# EAGLE design pwr_neg_bipolar (EAGLE 7.5.0)
Rusia Neagra MKII
TITLE: Rusia Neagra MKII
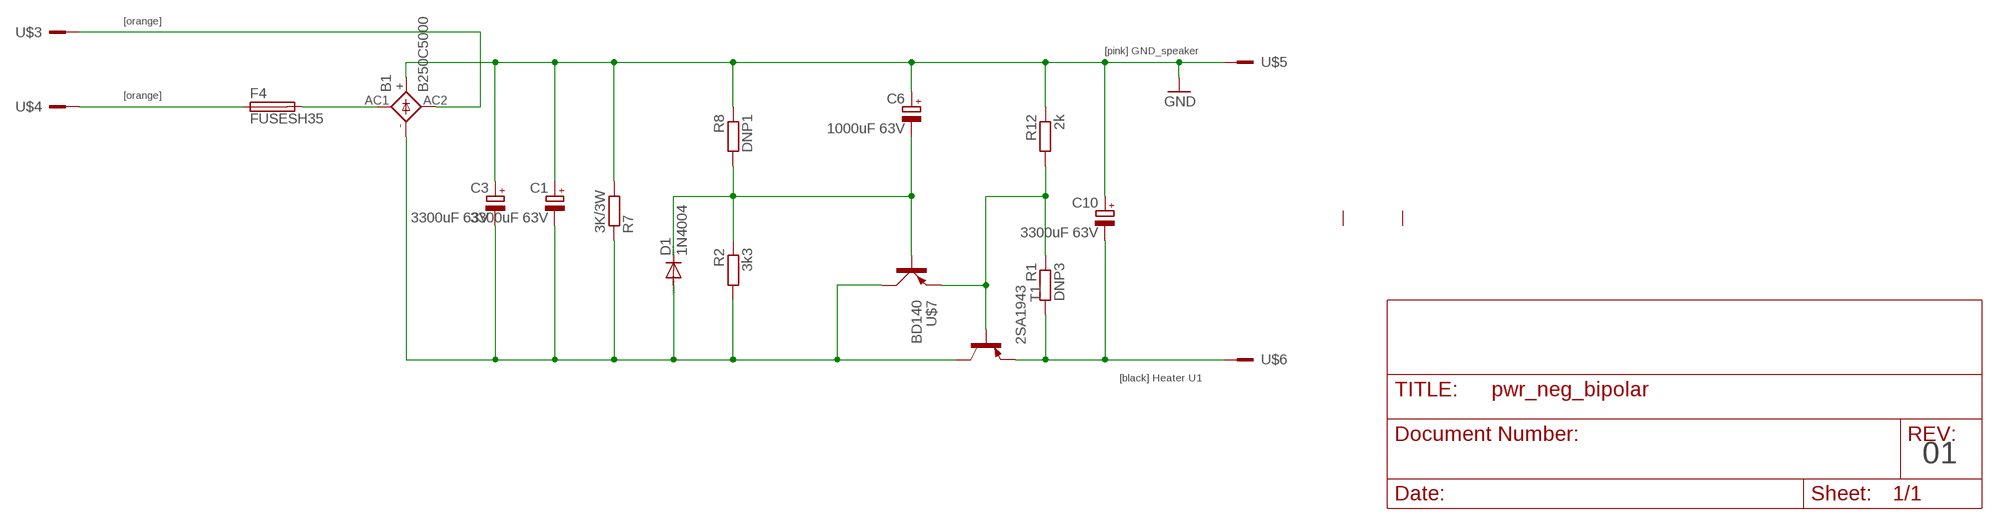
[diagram p0: schematic, sheet 1]

## Parts
B1  B250C5000  DIOTEC_BC5000  [DIOTEC_BC5000]
C1  3300uF 63V  CPOL-EUE10-20  [EB20D]
C3  3300uF 63V  CPOL-EUE10-20  [EB20D]
C6  1000uF 63V  CPOL-EUE7.5-16  [E7,5-16]
C10  3300uF 63V  CPOL-EUE10-20  [EB20D]
D1  1N4004  [DO41-10]
F4  FUSESH35  [SH25]
R1  DNP3  R-EU_0411/12  [0411/12]
R2  3k3  R-EU_0411/12  [0411/12]
R7  3K/3W  R-EU_0922V  [0922V]
R8  DNP1  R-EU_0411/12  [0411/12]
R12  2k  R-EU_0411/12  [0411/12]
T1  2SA1943  -PNP-TOP3V  [TOP3V]
U$1  SK456-60-3XM3L  [SK456-60-3XM3L]
U$2  RN_POWER  [RN]
U$3  M1  [M1_OFFSET]
U$4  M1  [M1_OFFSET]
U$5  M1  [M1_OFFSET]
U$6  M1  [M1_OFFSET]
U$7  BD140  PNP-POWER_VERT  [SOT32]

## Nets
30VAC_1: B1.AC2 U$3.1(KL)
30VAC_2: F4.1 U$4.1(KL)
GND: B1.+ C1.+ C3.+ C6.+ C10.+ R7.2 R8.1 R12.1 U$5.1(KL)
N$2: B1.AC1 F4.2
N$12: R1.1 R12.2 T1.B U$7.E
N$14: C6.- D1.C R2.1 R8.2 U$7.B
N_C: B1.- C1.- C3.- D1.A R2.2 R7.1 T1.C U$7.C
V-: C10.- R1.2 T1.E U$6.1(KL)
Unconnected: U$1.P$1 U$1.P$2 U$2.SH@1 U$2.SH@2 U$2.SH@3 U$2.SH@4

## Notes on the sheet
- [orange]
- [pink] GND_speaker
- [orange]
- [black] Heater U1
- 01

## Library data of the parts
B1 = Simplex-DiscreteSemi:DIOTEC_BC5000: DIOTEC RECTIFIER B..C5000-3000A, B..C5000-3300A grid 1 x 10, 2 x 7,5 mm
C1 C3 C6 C10 = rcl:CPOL-EU: POLARIZED CAPACITOR, European symbol
D1 = diode:1N4004: DIODE general purpose rectifier, 1 A
F4 = fuse:FUSE: Fuse; OC_FARNELL: unknown; OC_NEWARK: unknown
R1 R2 R7 R8 R12 = rcl:R-EU_: RESISTOR, European symbol
T1 = transistor:*-PNP-: PNP Transistror
U$1 = Simplex-Heatsinks:SK456-60-3XM3L: Fischer Elektronik SK456-60-3XM3L 2 pin heatsink 60x40, 40mm grid
U$2 = Simplex-Enclosures:RN_POWER: Rusia Neagra Amp power pcb
U$3-U$6 = Simplex-Connectors:M1: 1pin
U$7 = Simplex-DiscreteSemi:PNP-POWER: PNP power transistor

## Net classes
1 vcc: width 0.203 mm

## Board
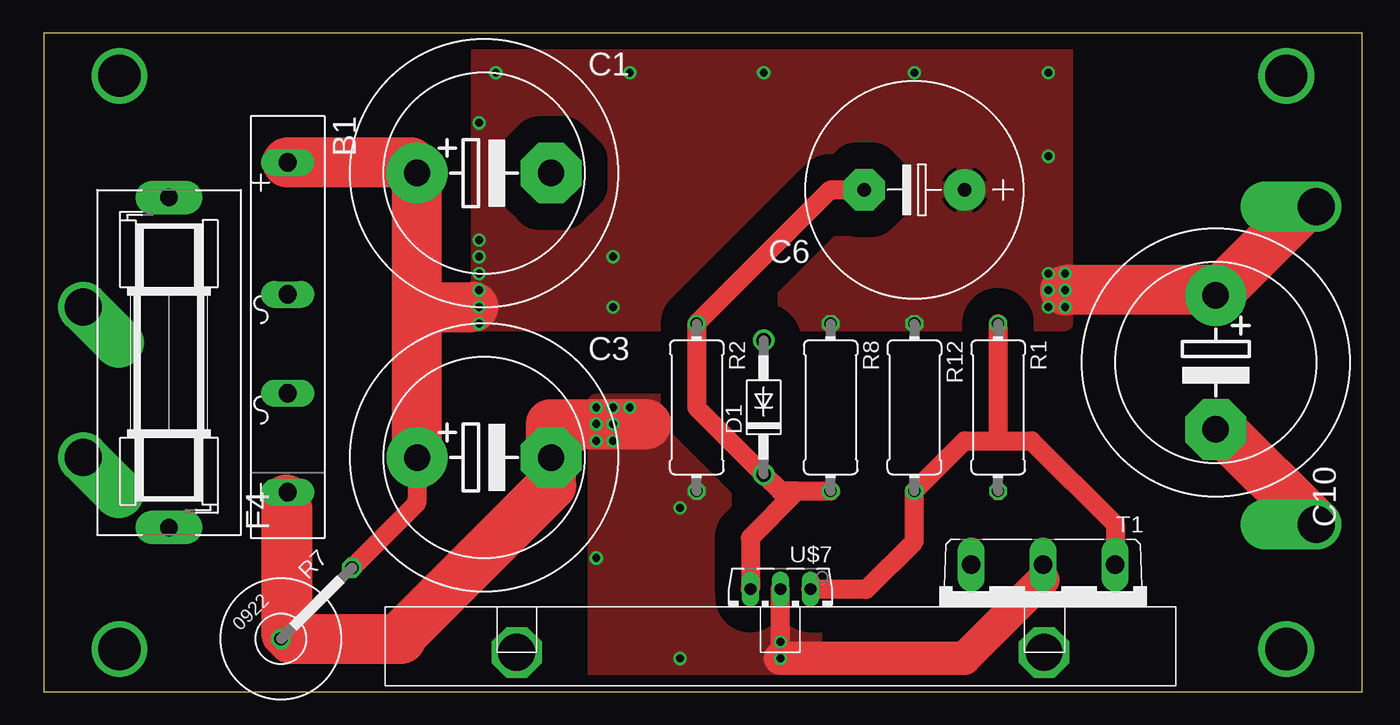
[diagram p1: board, top side]
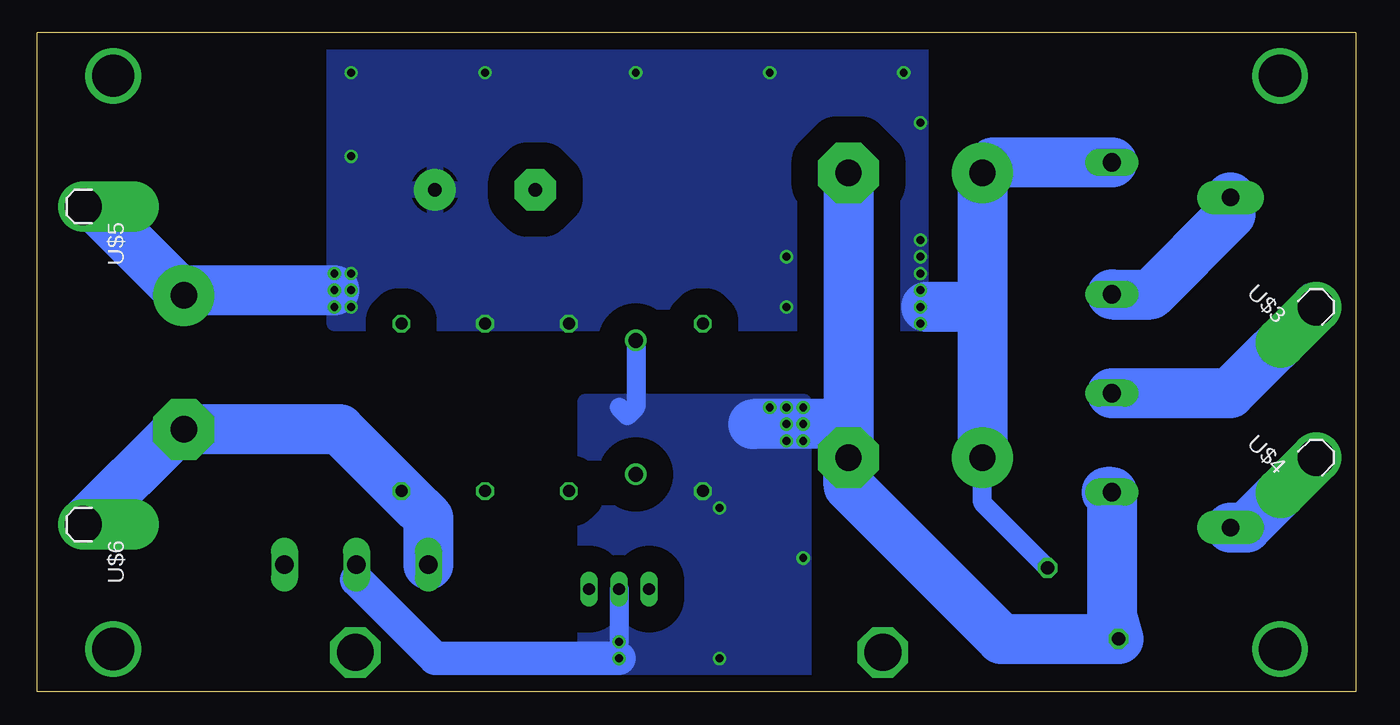
[diagram p2: board, bottom side, seen from below]

Size 100 x 50 mm. Coordinates in mm from the lower left corner, seen from the top.
Copper layers (1*16): Top 0.035mm / dielectric 1.5mm / Bottom 0.035mm
Design rules "default *": minimum track width 10mil, minimum drill 0.6mm, track to track 2mm, track to pad 2mm, pad to pad 2mm, via to via 2mm, smd to smd 2mm, copper to edge 40mil, drill to drill 8mil, minimum pad ring 0.15mm, minimum via ring 8mil, stop-mask expansion 4mil, vias tented up to drill 0mil, thermal gap 10mil

### Footprints (pad centres in the part's own frame; a part is rotated, then mirrored left to right if it is on the bottom)
DIOTEC_BC5000 = drill 1.397 long: + -13.5,0; - 11.5,0; AC1 -3.5,0; AC2 4,0
EB20D = drill 2.007 pad 4.597: + -5.08,0 | drill 2.007 pad 4.597 octagon: - 5.08,0
E7,5-16 = drill 1.016 pad 3.15: + -3.81,0 | drill 1.016 pad 3.15 octagon: - 3.81,0
DO41-10 = drill 1.118: A 5.08,0; C -5.08,0
SH25 = drill 1.321 pad 2.54 long: 1 -12.522,0; 2 12.522,0
0411/12 = drill 0.914 octagon: 1 -6.35,0; 2 6.35,0
0922V = drill 1.016 octagon: 1 -5.08,0; 2 2.54,0
TOP3V = drill 1.397 long: B -5.461,-3.175; C 0,-3.175; E 5.461,-3.175
SK456-60-3XM3L = drill 2.8 octagon: P$1 -20,0; P$2 20,0
RN = drill 3.2: SH@1 0,43.5; SH@2 88.5,43.5; SH@3 0,0; SH@4 88.5,0
M1_OFFSET = drill 2.8 pad 3.81 offset: 1 0,0
SOT32 = drill 0.9 pad 1.016 long: B 2.286,0; C 0,0; E -2.286,0

### Placement (x,y rotation side)
B1  18.5,26.67 270 top
C1  33.4,39.37 0 top
C3  33.4,17.78 0 top
C6  66.04,38.1 180 top
C10  88.9,25 270 top
D1  54.61,21.59 90 top
F4  9.5,25 90 top
R1  72.39,21.59 270 top
R2  49.53,21.59 270 top
R7  21.59,7.62 45 top
R8  59.69,21.59 270 top
R12  66.04,21.59 270 top
T1  75.8,6.5 180 top
U$1  55.88,3 0 top
U$2  5.75,3.25 0 top
U$3  3,29.21 135 bottom
U$4  3,17.78 135 bottom
U$5  96.52,36.83 270 bottom
U$6  96.52,12.7 270 bottom
U$7  55.88,7.8 180 top

### Tracks (layer width: path | path; a pad name or v marks a point on that pad's centre or on a via)
30VAC_1
  Bottom 3.81: B1.AC2 9.54,22.67 U$3.1
30VAC_2
  Bottom 3.81: F4.1 8.3,12.48 U$4.1
GND  (via drill 0.6 pad 0.3)
  Top 1.422: R7.2 28.32,14.35 | 28.32,18.04 C3.+ | C3.+ 28.32,14.61 | C3.+ 28.32,29.21 v33.02,29.21
  Top 3.81: v77.47,30.48 88.5,30.48 C10.+ 95.65,36.83 | 28.32,29.21 C1.+ | 28.32,18.41 28.32,29.21 | 28.32,29.21 32.6,29.21 | 27.86,40.17 B1.+
  Bottom 0.406: 32.6,29.21 v33.02,29.21
  Bottom 1.422: R7.2 28.32,14.35 C3.+
  Bottom 3.81: v77.47,30.48 88.5,30.48 C10.+ 95.65,36.83 U$5.1 | 28.32,29.21 C3.+ | B1.+ 27.52,40.17 C1.+ 28.32,29.21 | 28.32,29.21 32.6,29.21
  other vias: 34.29,46.99 43.18,33.02 33.02,43.18 76.2,40.64 76.2,46.99 77.47,29.21 44.45,46.99 54.61,46.99 66.04,46.99 43.18,29.21 33.02,33.02 76.2,30.48 76.2,31.75 33.02,30.48 33.02,27.94 33.02,31.75 33.02,34.29 77.47,31.75 76.2,29.21
  pour Bottom (isolate 1.27): 77.47,49.53 33.02,49.53 33.02,28 77.47,28
  pour Top (isolate 1.27): 33.02,49.53 77.47,49.53 77.47,28 33.02,28
N$2
  Bottom 3.81: B1.AC1 15.55,30.17 9.5,36.22 F4.2
N$12
  Top 1.27: 81.28,9.29 T1.B
  Top 1.422: 81.28,9.29 81.28,12.7 74.93,19.05 72.39,19.05 | U$7.E 58.32,7.77 62.38,7.77 66.04,11.43 R12.2 69.85,19.05 72.39,19.05 | R1.1 72.39,19.05
N$14
  Top 1.422: 57.15,15.24 53.59,11.68 U$7.B | 57.15,15.24 R8.2 | C6.- 59.69,38.1 R2.1 49.53,21.59 D1.C 55.88,15.24 57.15,15.24
N_C  (via drill 0.6 pad 0.3)
  Top 0.406: 26.93,4.07 27.3,4.07 27.3,4.45 | 18.83,4.03 R7.1
  Top 1.27: T1.C 75.8,8.49
  Top 1.422: v55.88,2.54 U$7.C | 18.41,15.24 18.41,4.45 27.94,4.45 38.1,14.61 38.1,16.51 v41.91,20.32 | 18.5,4.51 B1.-
  Top 2.54: 75.8,8.49 69.85,2.54 v55.88,2.54
  Top 3.81: 26.93,4.07 27.3,4.45 38.52,15.66 38.48,15.66 38.48,20.32 v41.91,20.32 45.72,20.32 | 27.09,4.03 18.83,4.03 18.41,4.45 18.41,14.61 | 18.5,4.51 18.5,13.88
  Bottom 1.422: 55.88,21.59 55.24,20.95 54.61,21.59 D1.A | U$7.C v55.88,3.81
  Bottom 2.54: 75.8,8.49 69.85,2.54 v55.88,2.54
  Bottom 3.81: C1.- C3.- | 18.9,15.17 B1.- 18.5,5.8 R7.1 26.89,4.03 38.48,15.62 C3.- | C3.- 38.48,20.32 45.72,20.32
  other vias: 41.91,10.16 48.26,2.54 44.45,21.59 48.26,13.97 41.91,21.59 43.18,21.59 43.18,19.05 43.18,20.32 41.91,19.05
  pour Bottom (isolate 1.27): 41.91,22 58.42,22 58.42,1.27 41.91,1.27
  pour Top (isolate 1.27): 41.91,22 58.42,22 58.42,1.27 41.91,1.27
V-
  Top 3.81: 89.3,19.92 U$6.1
  Bottom 1.016: 70.34,10.94 T1.E | 72.39,13.97 71.75,14.61
  Bottom 1.422: R1.2 72.39,13.97
  Bottom 3.81: T1.E 70.34,13.19 71.75,14.61 77.07,19.92 C10.- 89.3,19.92 U$6.1

### Text on the board
tDocu: bipolar negative supply | GND | ~ | ~ | V-
bDocu: bipolar negative supply | GND | ~ | ~ | V-